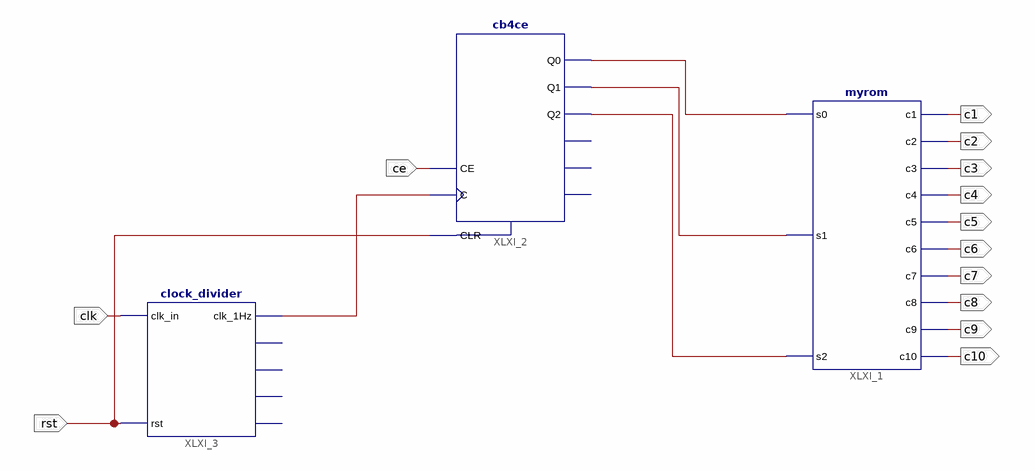
[diagram p0: schematic sheet 1]
// Xilinx ISE schematic ab.sch (spartan6) as structural Verilog: 3 symbols, 13 ports
module ab (
  input  clk,
  input  rst,
  input  ce,
  output c1,
  output c2,
  output c3,
  output c4,
  output c5,
  output c6,
  output c7,
  output c8,
  output c9,
  output c10
);

  wire XLXN_14, XLXN_16, XLXN_17, XLXN_18;

  myrom XLXI_1 (
    .s0(XLXN_16), .s1(XLXN_17), .s2(XLXN_18), .c1(c1), .c2(c2), .c3(c3), .c4(c4), .c5(c5), .c6(c6), .c7(c7),
    .c8(c8), .c9(c9), .c10(c10));
  cb4ce XLXI_2 (.C(XLXN_14), .CE(ce), .CLR(rst), .Q0(XLXN_16), .Q1(XLXN_17), .Q2(XLXN_18));  // open: CEO, Q3, TC
  clock_divider XLXI_3 (.clk_in(clk), .rst(rst), .clk_1Hz(XLXN_14));  // open: clk_5Hz, clk_10Hz, clk_1KHz, clk_1MHz
endmodule
